# Altium schematic sheet Trepanat_Output.SchDoc
size 594 x 420 mm; DocumentNumber: ПРО 2018.001 Э3; SheetNumber: 2; Format: A2
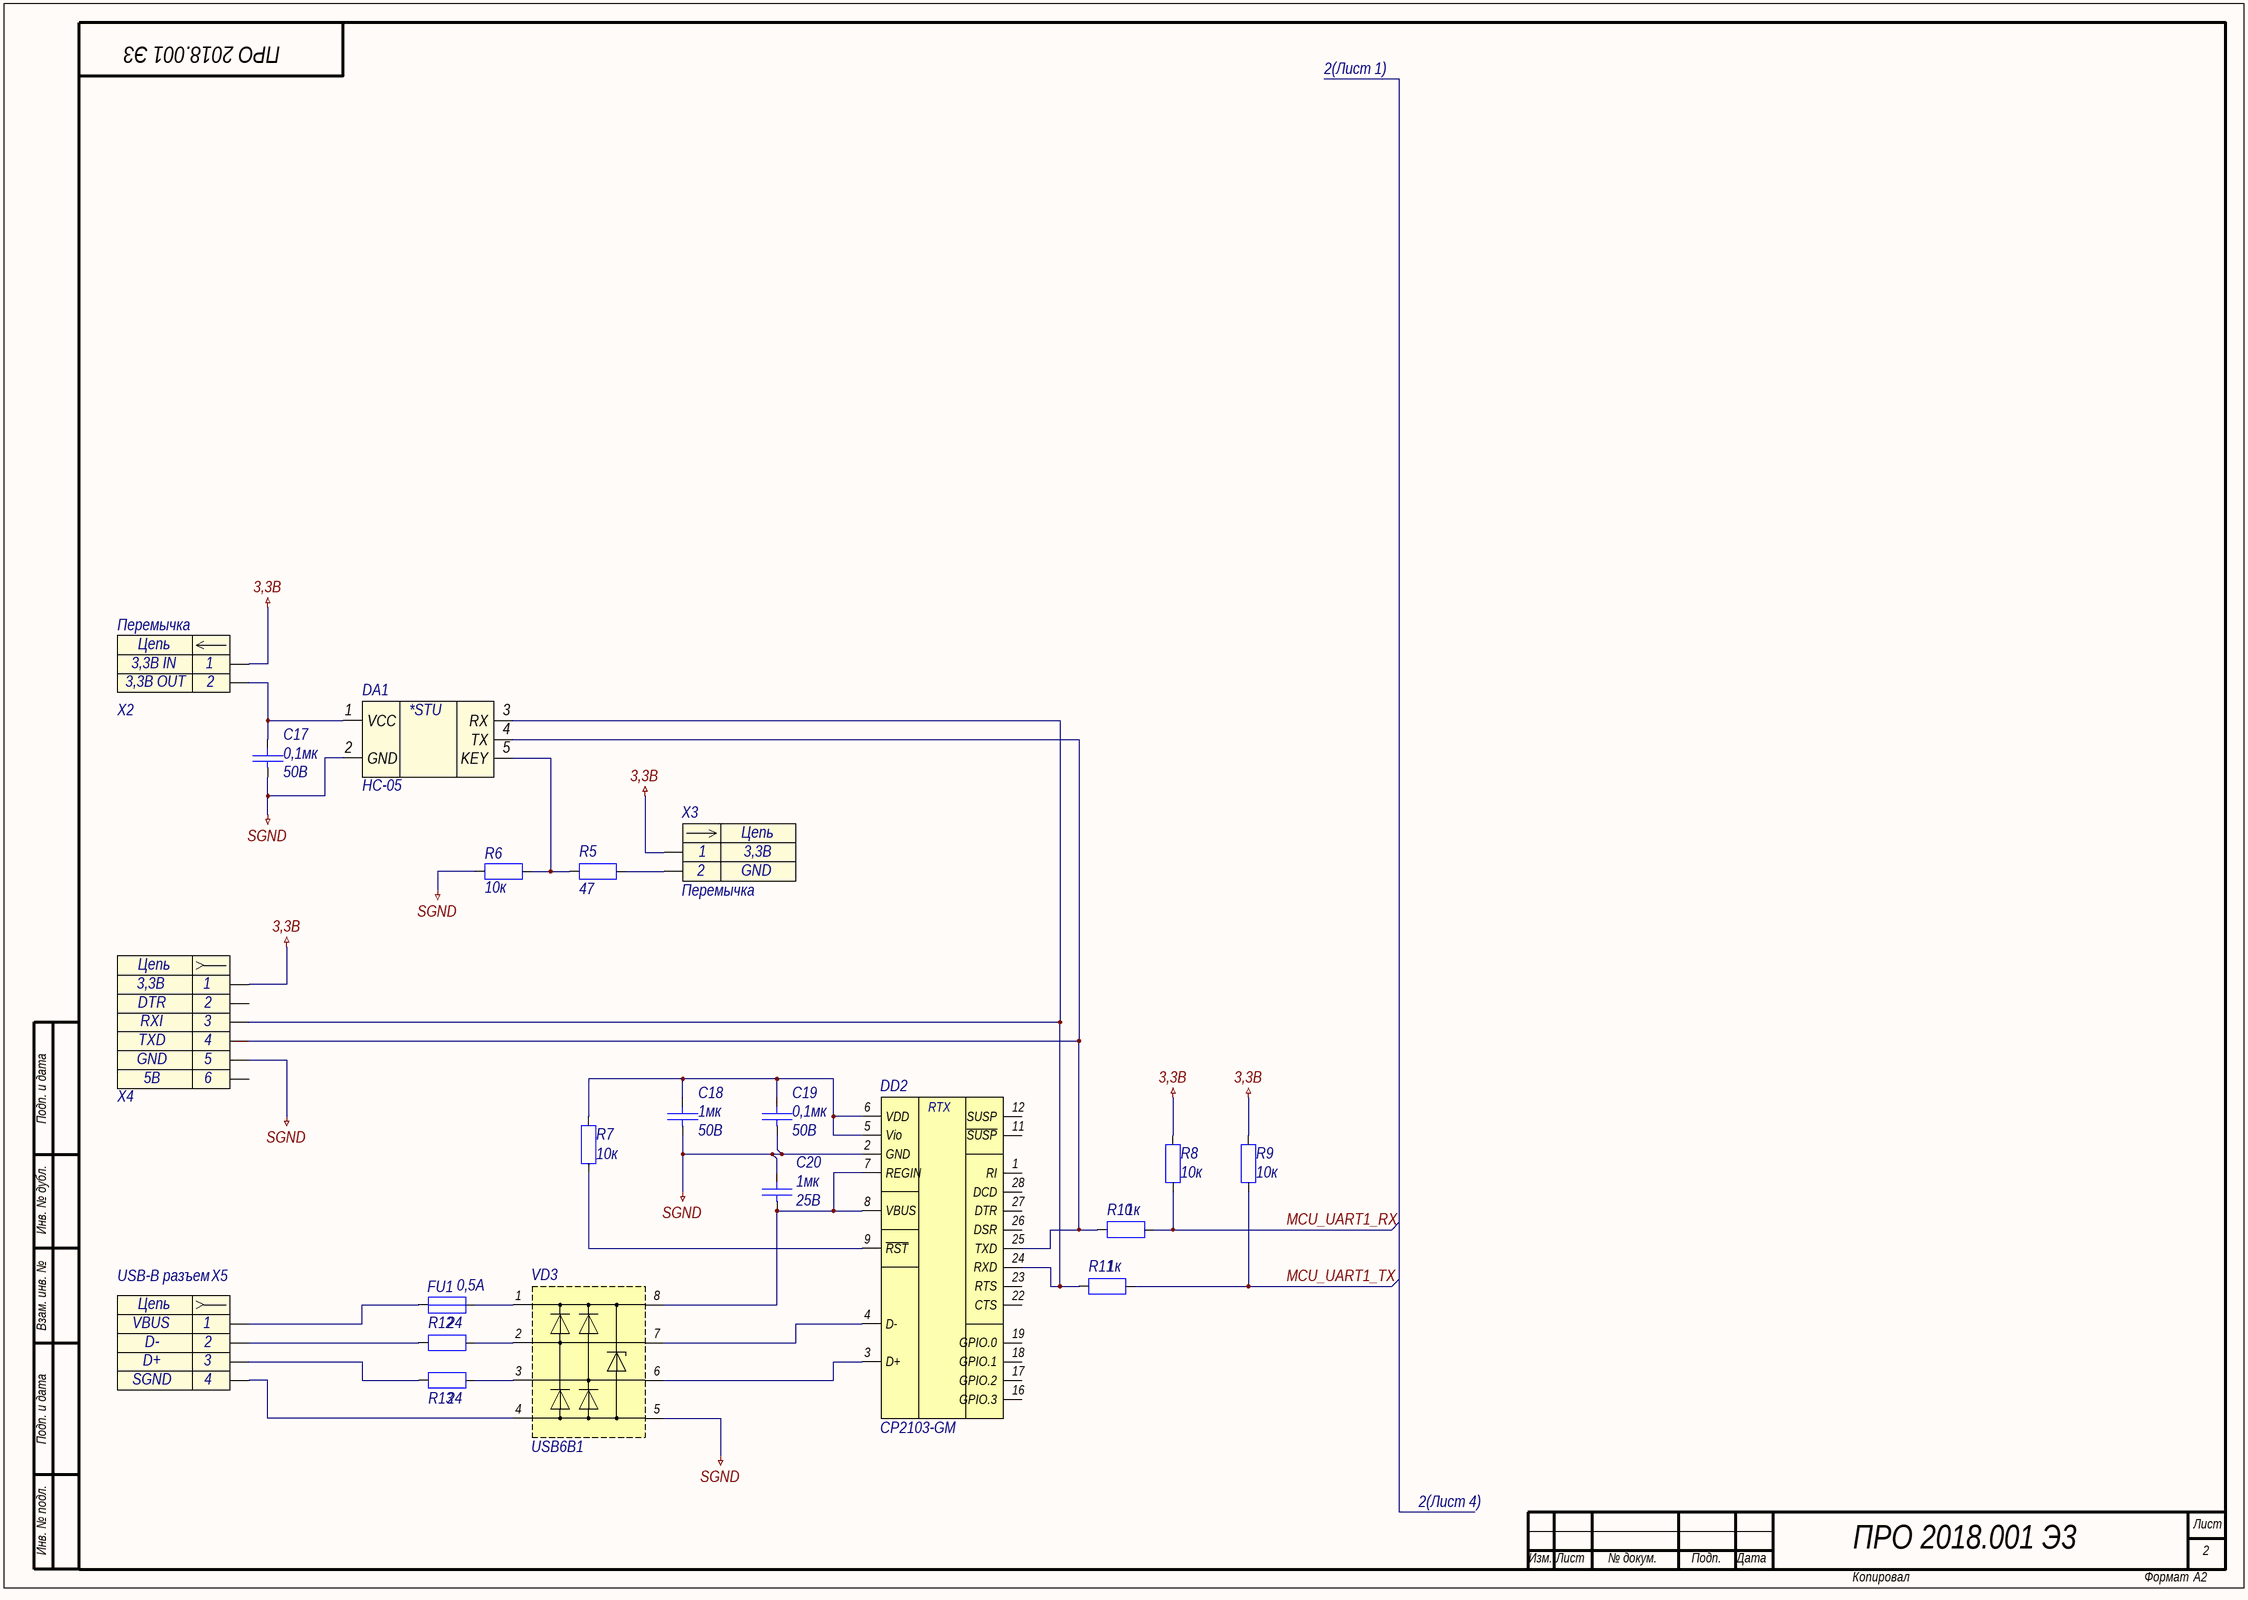
[diagram p0: Trepanat_Output.SchDoc]

## Parts
C17  0,1мк  Voltage: 50В  [C0805]
C18  1мк  Voltage: 50В  [C0805]
C19  0,1мк  Voltage: 50В  [C0805]
C20  1мк  Voltage: 25В  [C0805]
DA1  HC-05  [HC-05]
DD2  CP2103-GM  [QFN28]
FU1  value 0,5A  [R1812]  (hidden comment: MF-MSMF050)
R5  47  [R0805]
R6  10к  [R0805]
R7  10к  [R0805]
R8  10к  [R0805]
R9  10к  [R0805]
R10  1к  [R0805]
R11  1к  [R0805]
R12  24  [R0805]
R13  24  [R0805]
VD3  USB6B1  [SO8]
X2  Перемычка  [PLS2-2]
X3  Перемычка  [PLS2-2]
X4  (no value)  [PLS-6]
X5  670687041  [USBB-J1]  (value not drawn)

## Nets
3,3B: R8.1 R9.1 X2.1 X3.1 X4.1
SGND: C17.1 C18.1 C19.1 C20.2 DA1.2(GND) DD2.2(GND) R6.1 VD3.5 X4.5
MCU_UART1_RX: R8.2 R10.1
MCU_UART1_TX: R9.2 R11.1
NetC17_2: C17.2 DA1.1(VCC) X2.2
NetC18_2: C18.2 C19.2 DD2.5(Vio) DD2.6(VDD) R7.1
NetC20_1: C20.1 DD2.7(REGIN) DD2.8(VBUS) VD3.8
NetDA1_3: DA1.3(RX) DD2.24(RXD) R11.2 X4.3
NetDA1_4: DA1.4(TX) DD2.25(TXD) R10.2 X4.4
NetDA1_5: DA1.5(KEY) R5.2 R6.2
NetDD2_3: DD2.3(D+) VD3.6
NetDD2_4: DD2.4(D-) VD3.7
NetDD2_9: DD2.9(~{RST}) R7.2
NetFU1_1: FU1.1 X5.1
NetFU1_2: FU1.2 VD3.1
NetR5_1: R5.1 X3.2
NetR12_1: R12.1 X5.2
NetR12_2: R12.2 VD3.2
NetR13_1: R13.1 X5.3
NetR13_2: R13.2 VD3.3
NetVD3_4: VD3.4 X5.4

Not connected (* = marked no-connect by the designer): DD2 1(RI) 11(~{SUSP}) 12(SUSP) 16(GPIO.3) 17(GPIO.2) 18(GPIO.1) 19(GPIO.0) 22(CTS) 23(RTS) 26(DSR) 27(DTR) 28(DCD); X4 2 6

## Notes on the sheet
- 2(Лист 1)
- Подп. и дата
- Инв. № дубл.
- Взам. инв. №
- USB-B разъем
- 2(Лист 4)
- Инв. № подл.
- Лист
- Изм.
- № докум.
- Подп.
- Дата
- Копировал
- Формат
- (in symbol CP2103) RTX
- (in symbol HC-05) *STU
- (in symbol Header_2_plg) Цепь
- (in symbol Header_4_sct) Цепь
- (in symbol Header_6_sct) Цепь

## Library data of the parts
C17-C20 = Capacitor: Конденсатор
  C17 C19: Value: 0,1мк
  C18 C20: Value: 1мк
DA1 = HC-05: Bluetooth HC-05; Name: HC-05
DD2 = CP2103: USB-UART преобразователь; Name: CP2103-GM
FU1 = Fuse: Предохранитель; Name: MF-MSMF050
R5-R13 = Resistor: Резистор
  R5: Value: 47
  R6-R9: Value: 10к
  R10 R11: Value: 1к
  R12 R13: Value: 24
VD3 = USB6B1: Защита линии данных; Name: USB6B1
X2 = Header_2_plg: Разъем - 2 конт. вилка; Contact_1: 3,3В IN; Contact_2: 3,3В OUT; Name: Перемычка
X3 = Header_2_plg: Разъем - 2 конт. вилка; Contact_1: 3,3В; Contact_2: GND; Name: Перемычка
X4 = Header_6_sct: Разъем - 5 конт. розетка; Contact_1: 3,3В; Contact_2: DTR; Contact_3: RXI; Contact_4: TXD; Contact_5: GND; Contact_6: 5B
X5 = Header_4_sct: Разъем - 4 конт. розетка; Contact_1: VBUS; Contact_2: D-; Contact_3: D+; Contact_4: SGND; Name: 670687041